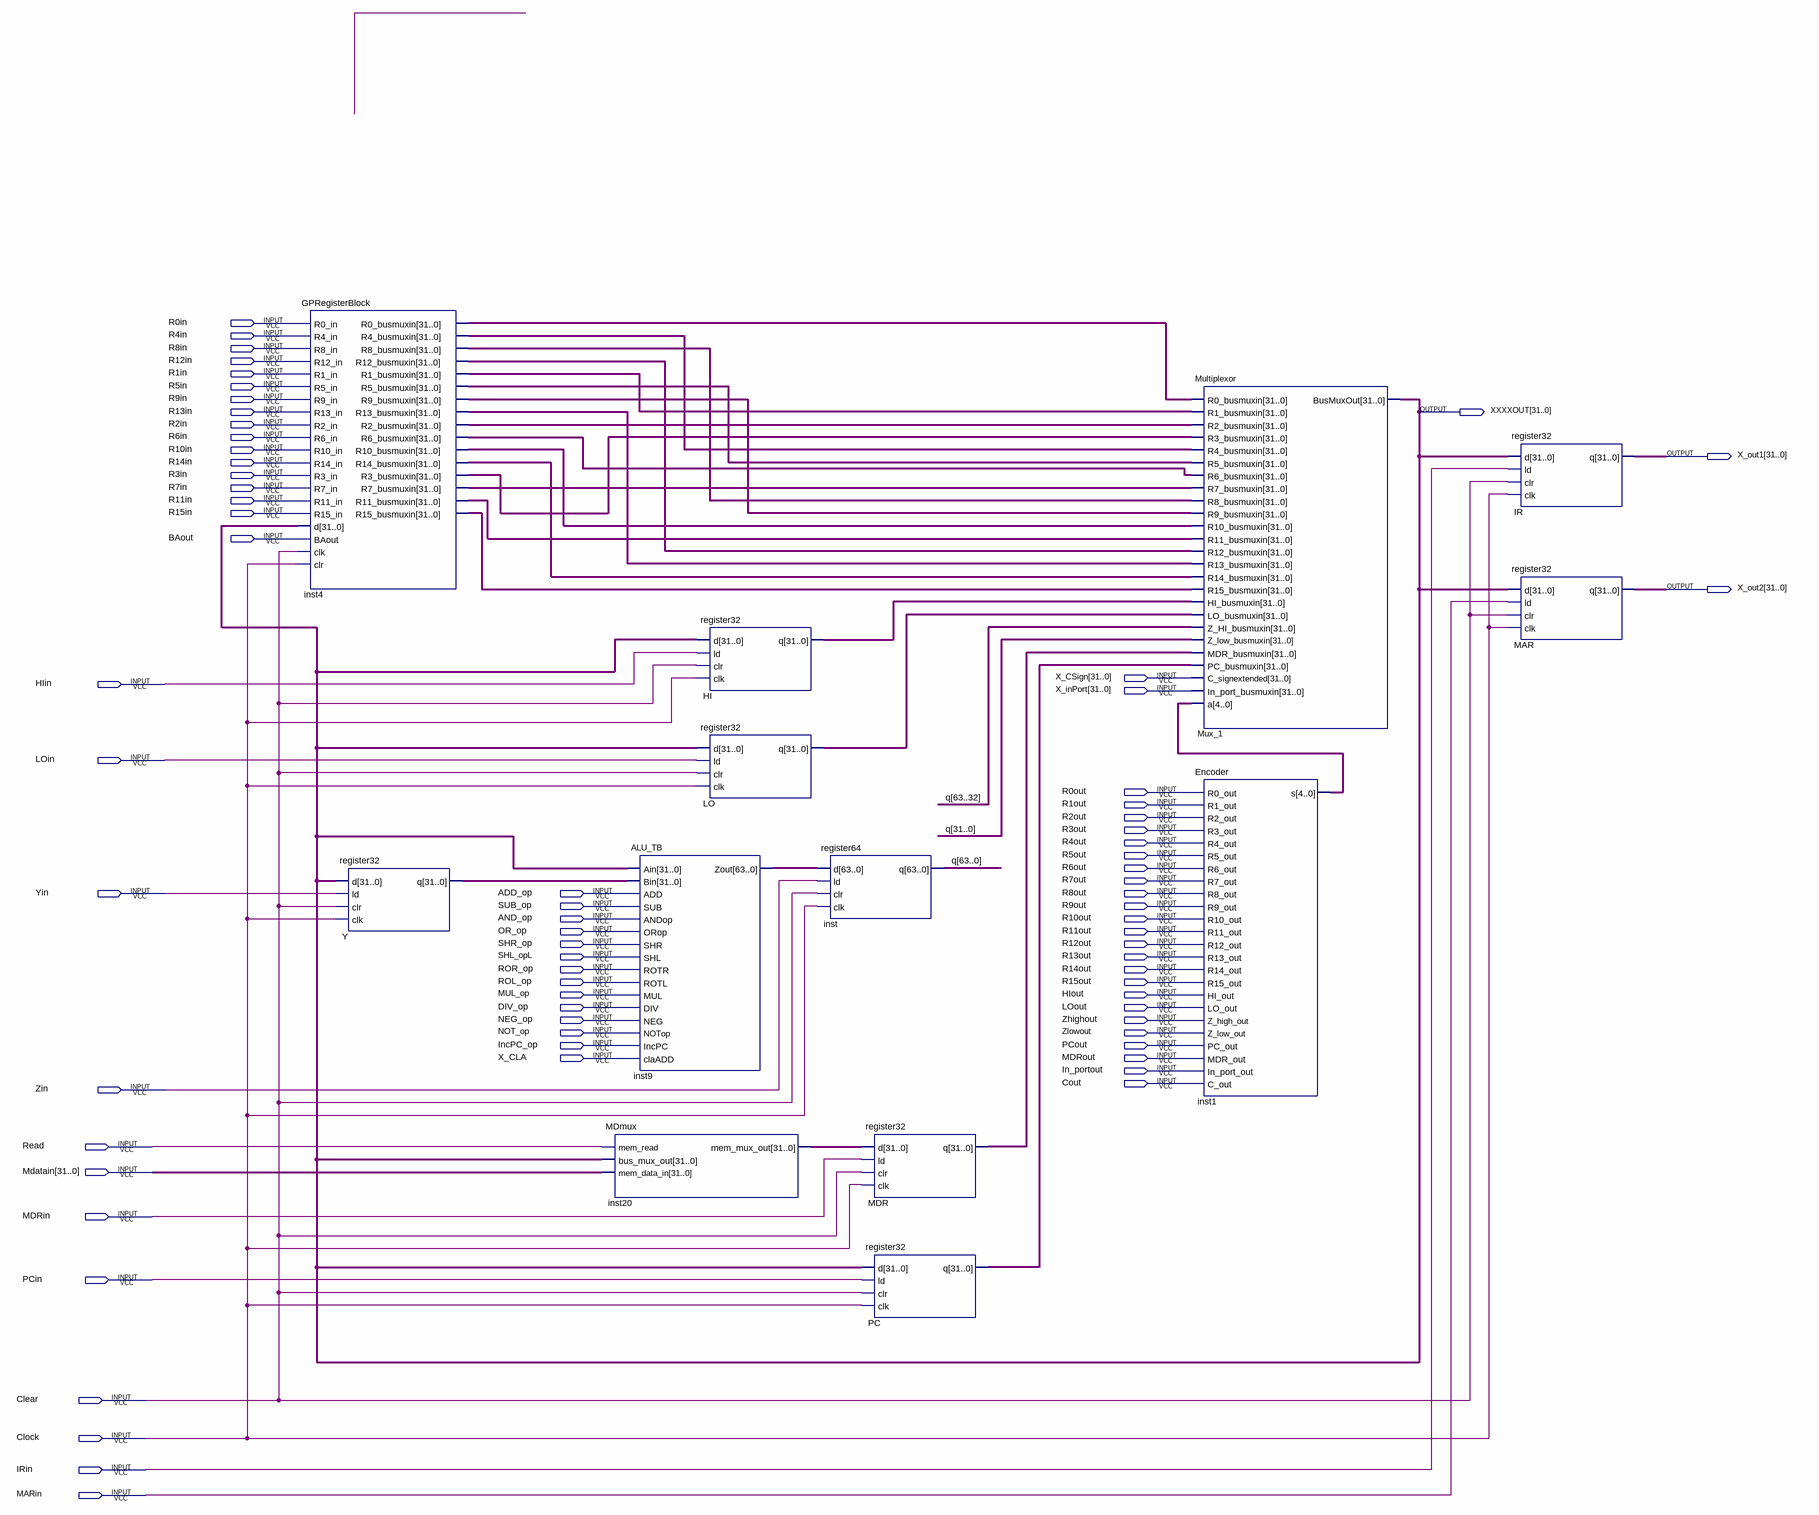
[diagram p0: schematic sheet]
// Quartus schematic Datapath.bdf as structural Verilog: 13 symbols, 72 pins
module Datapath (
  input  R0in,
  input  R4in,
  input  R8in,
  input  R12in,
  input  R1in,
  input  R5in,
  input  R9in,
  input  R13in,
  input  R2in,
  input  R6in,
  input  R10in,
  input  R14in,
  input  R3in,
  input  R7in,
  input  R11in,
  input  R15in,
  input  BAout,
  input  [31:0] X_CSign,
  input  HIin,
  input  [31:0] X_inPort,
  input  LOin,
  input  R0out,
  input  R1out,
  input  R2out,
  input  R3out,
  input  R4out,
  input  R5out,
  input  R6out,
  input  R7out,
  input  Yin,
  input  ADD_op,
  input  R8out,
  input  SUB_op,
  input  R9out,
  input  AND_op,
  input  R10out,
  input  OR_op,
  input  R11out,
  input  SHR_op,
  input  R12out,
  input  SHL_opL,
  input  R13out,
  input  ROR_op,
  input  R14out,
  input  ROL_op,
  input  R15out,
  input  MUL_op,
  input  HIout,
  input  DIV_op,
  input  LOout,
  input  NEG_op,
  input  Zhighout,
  input  NOT_op,
  input  Zlowout,
  input  IncPC_op,
  input  PCout,
  input  X_CLA,
  input  MDRout,
  input  In_portout,
  input  Cout,
  input  Zin,
  input  Read,
  input  [31:0] Mdatain,
  input  MDRin,
  input  PCin,
  input  Clear,
  input  Clock,
  input  IRin,
  input  MARin,
  output [31:0] XXXXOUT,
  output [31:0] X_out1,
  output [31:0] X_out2
);

  wire [4:0] inst1_s;
  wire [31:0] HI_q, inst4_r0_busmuxin, inst4_r1_busmuxin, inst4_r2_busmuxin, inst4_r3_busmuxin,
       inst4_r4_busmuxin, inst4_r5_busmuxin, inst4_r6_busmuxin, inst4_r7_busmuxin, inst4_r8_busmuxin,
       inst4_r9_busmuxin, inst4_r10_busmuxin, inst4_r11_busmuxin, inst4_r12_busmuxin, inst4_r13_busmuxin,
       inst4_r14_busmuxin, inst4_r15_busmuxin, inst20_mem_mux_out, LO_q, MDR_q, PC_q, Y_q;
  wire [63:0] inst9_zout, q;

  GPRegisterBlock inst4 (
    .R0_in(R0in), .R4_in(R4in), .R8_in(R8in), .R12_in(R12in), .R1_in(R1in), .R5_in(R5in), .R9_in(R9in),
    .R13_in(R13in), .R2_in(R2in), .R6_in(R6in), .R10_in(R10in), .R14_in(R14in), .R3_in(R3in), .R7_in(R7in),
    .R11_in(R11in), .R15_in(R15in), .d(XXXXOUT), .BAout(BAout), .clk(Clear), .clr(Clock),
    .R0_busmuxin(inst4_r0_busmuxin), .R4_busmuxin(inst4_r4_busmuxin), .R8_busmuxin(inst4_r8_busmuxin),
    .R12_busmuxin(inst4_r12_busmuxin), .R1_busmuxin(inst4_r1_busmuxin), .R5_busmuxin(inst4_r5_busmuxin),
    .R9_busmuxin(inst4_r9_busmuxin), .R13_busmuxin(inst4_r13_busmuxin), .R2_busmuxin(inst4_r2_busmuxin),
    .R6_busmuxin(inst4_r6_busmuxin), .R10_busmuxin(inst4_r10_busmuxin), .R14_busmuxin(inst4_r14_busmuxin),
    .R3_busmuxin(inst4_r3_busmuxin), .R7_busmuxin(inst4_r7_busmuxin), .R11_busmuxin(inst4_r11_busmuxin),
    .R15_busmuxin(inst4_r15_busmuxin));
  register32 Y (.d(XXXXOUT), .ld(Yin), .clr(Clear), .clk(Clock), .q(Y_q));
  ALU_TB inst9 (
    .Ain(XXXXOUT), .Bin(Y_q), .ADD(ADD_op), .SUB(SUB_op), .ANDop(AND_op), .ORop(OR_op), .SHR(SHR_op),
    .SHL(SHL_opL), .ROTR(ROR_op), .ROTL(ROL_op), .MUL(MUL_op), .DIV(DIV_op), .NEG(NEG_op), .NOTop(NOT_op),
    .IncPC(IncPC_op), .claADD(X_CLA), .Zout(inst9_zout));
  MDmux inst20 (.mem_read(Read), .bus_mux_out(XXXXOUT), .mem_data_in(Mdatain), .mem_mux_out(inst20_mem_mux_out));
  register32 HI (.d(XXXXOUT), .ld(HIin), .clr(Clear), .clk(Clock), .q(HI_q));
  register32 LO (.d(XXXXOUT), .ld(LOin), .clr(Clear), .clk(Clock), .q(LO_q));
  register64 inst (.d(inst9_zout), .ld(Zin), .clr(Clear), .clk(Clock), .q(q));
  register32 MDR (.d(inst20_mem_mux_out), .ld(MDRin), .clr(Clear), .clk(Clock), .q(MDR_q));
  register32 PC (.d(XXXXOUT), .ld(PCin), .clr(Clear), .clk(Clock), .q(PC_q));
  Multiplexor Mux_1 (
    .R0_busmuxin(inst4_r0_busmuxin), .R1_busmuxin(inst4_r1_busmuxin), .R2_busmuxin(inst4_r2_busmuxin),
    .R3_busmuxin(inst4_r3_busmuxin), .R4_busmuxin(inst4_r4_busmuxin), .R5_busmuxin(inst4_r5_busmuxin),
    .R6_busmuxin(inst4_r6_busmuxin), .R7_busmuxin(inst4_r7_busmuxin), .R8_busmuxin(inst4_r8_busmuxin),
    .R9_busmuxin(inst4_r9_busmuxin), .R10_busmuxin(inst4_r10_busmuxin), .R11_busmuxin(inst4_r11_busmuxin),
    .R12_busmuxin(inst4_r12_busmuxin), .R13_busmuxin(inst4_r13_busmuxin), .R14_busmuxin(inst4_r14_busmuxin),
    .R15_busmuxin(inst4_r15_busmuxin), .HI_busmuxin(HI_q), .LO_busmuxin(LO_q), .Z_HI_busmuxin(q[63:32]),
    .Z_low_busmuxin(q[31:0]), .MDR_busmuxin(MDR_q), .PC_busmuxin(PC_q), .C_signextended(X_CSign),
    .In_port_busmuxin(X_inPort), .a(inst1_s), .BusMuxOut(XXXXOUT));
  Encoder inst1 (
    .R0_out(R0out), .R1_out(R1out), .R2_out(R2out), .R3_out(R3out), .R4_out(R4out), .R5_out(R5out),
    .R6_out(R6out), .R7_out(R7out), .R8_out(R8out), .R9_out(R9out), .R10_out(R10out), .R11_out(R11out),
    .R12_out(R12out), .R13_out(R13out), .R14_out(R14out), .R15_out(R15out), .HI_out(HIout), .LO_out(LOout),
    .Z_high_out(Zhighout), .Z_low_out(Zlowout), .PC_out(PCout), .MDR_out(MDRout), .In_port_out(In_portout),
    .C_out(Cout), .s(inst1_s));
  register32 IR (.d(XXXXOUT), .ld(IRin), .clr(Clear), .clk(Clock), .q(X_out1));
  register32 MAR (.d(XXXXOUT), .ld(MARin), .clr(Clear), .clk(Clock), .q(X_out2));
endmodule
